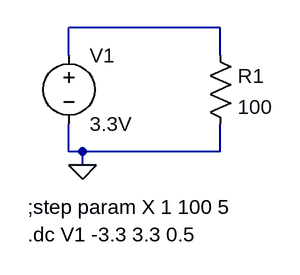
[diagram p0: schematic iv_char_resistor.asc]
iv_char_resistor.asc, the LTspice schematic file:
Version 4
SHEET 1 880 680
WIRE 224 80 48 80
WIRE 48 112 48 80
WIRE 224 112 224 80
WIRE 48 224 48 192
WIRE 64 224 48 224
WIRE 224 224 224 192
WIRE 224 224 64 224
WIRE 64 240 64 224
FLAG 64 240 0
SYMBOL res 208 96 R0
SYMATTR InstName R1
SYMATTR Value 100
SYMBOL voltage 48 96 R0
WINDOW 123 0 0 Left 0
WINDOW 39 0 0 Left 0
SYMATTR InstName V1
SYMATTR Value 3.3V
TEXT 0 288 Left 2 !;step param X 1 100 5
TEXT 0 320 Left 2 !.dc V1 -3.3 3.3 0.5

The netlist it stands for:
* iv_char_resistor.asc
R1 N001 0 100
V1 N001 0 3.3V
;step param X 1 100 5
.dc V1 -3.3 3.3 0.5
.backanno
.end